# EAGLE design BlinkyBoard_NickBluhm_RevA (EAGLE 9.0.1)
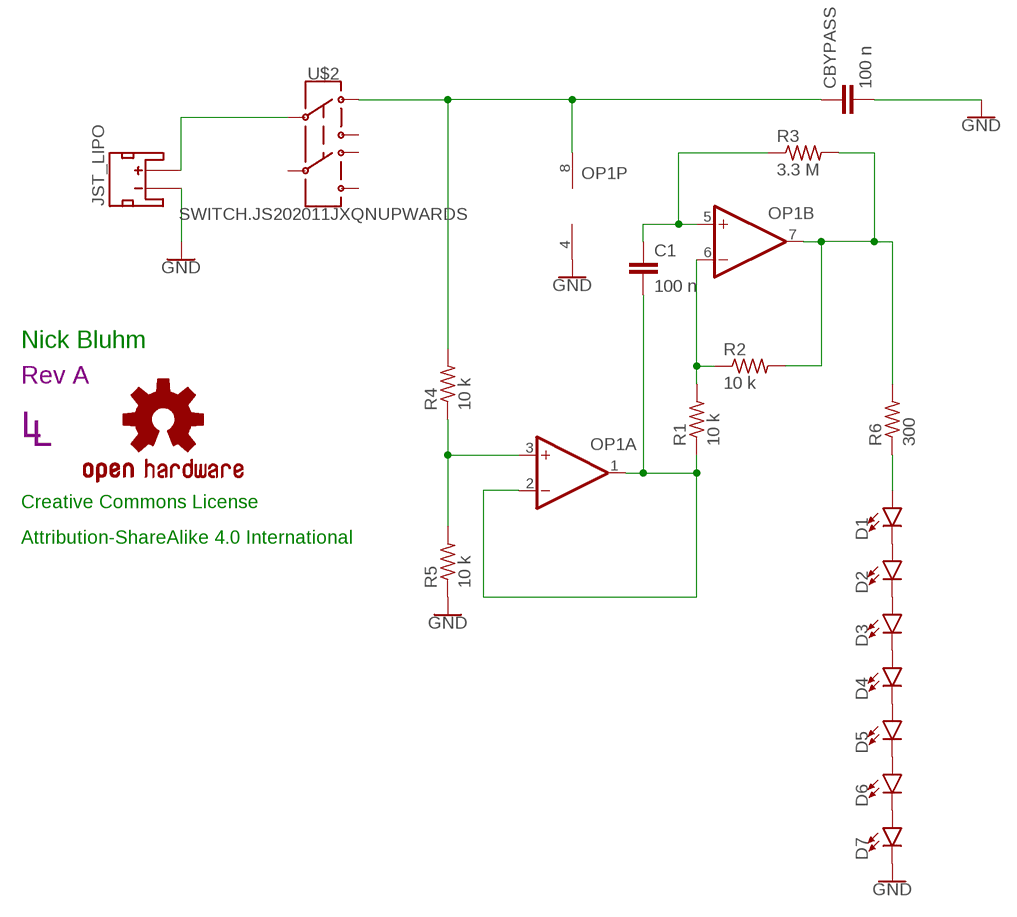
[diagram p0: schematic, sheet 1]

## Parts
C1  100 n  CAPACITOR0402  [C0402]
CBYPASS  100 n  CAPACITOR0402  [C0402]
D1  LED0603  [LED-0603]
D2  LED0603  [LED-0603]
D3  LED0603  [LED-0603]
D4  LED0603  [LED-0603]
D5  LED0603  [LED-0603]
D6  LED0603  [LED-0603]
D7  LED0603  [LED-0603]
JST_LIPO  3.7 V  JST_2MM_MALE  [JST-2-SMD]
LOGO1  OSHW-LOGOL-COPPER  [OSHW-LOGO-L_COPPER]
OP1  OP-DUALRM  [MSOP08]
R1  10 k  RESISTOR0402  [R0402]
R2  10 k  RESISTOR0402  [R0402]
R3  3.3 M  RESISTOR0402  [R0402]
R4  10 k  RESISTOR0402  [R0402]
R5  10 k  RESISTOR0402  [R0402]
R6  300  RESISTOR0402  [R0402]
U$2  SWITCH.JS202011JXQNUPWARDS  [SWITCH.00]
U$4  REVISION.A  [REV.A]
U$5  LINNES.LAB.LOGO  [LINNES.LAB.LOGO]

## Nets
GND: CBYPASS.2 D7.C JST_LIPO.1(-) OP1.4(P:V-) R5.1
N$1: JST_LIPO.2(+) U$2.2
N$2: CBYPASS.1 OP1.8(P:V+) R4.2 U$2.1
N$3: OP1.3(A:+IN) R4.1 R5.2
N$4: C1.2 OP1.1(A:OUT) OP1.2(A:-IN) R1.1
N$5: OP1.6(B:-IN) R1.2 R2.1
N$6: C1.1 OP1.5(B:+IN) R3.1
N$7: OP1.7(B:OUT) R2.2 R3.2 R6.2
N$8: D1.A R6.1
N$9: D1.C D2.A
N$10: D2.C D3.A
N$11: D3.C D4.A
N$12: D4.C D5.A
N$13: D5.C D6.A
N$14: D6.C D7.A
Unconnected: JST_LIPO.NC1(PAD1) JST_LIPO.NC2(PAD2) U$2.3 U$2.5 U$2.6 U$2.7

## Notes on the sheet
- Nick Bluhm
- Creative Commons License
- Attribution-ShareAlike 4.0 International

## Library data of the parts
C1 CBYPASS = CalvEngIO-Passives:CAPACITOR
D1-D7 = CalvEngIO-LED:LED: LED (Generic) Standard schematic elements and footprints for 5mm, 3mm, 1206, and 0603 sized LEDs. Generic LEDs with no color specified. LTST-C190KGKT: arrow indicates cathode
JST_LIPO = CalvEngIO-Connectors:JST_2MM_MALE: JST 2MM MALE RA CONNECTOR Two pin, compact surface mount connector. Commonly used as a battery input connection point. We really like the solid locking feeling and high current rating on these small connectors. We use these all the time as battery connectors. Mates to single-cell LiPo batteries. Here is the connector we sell at SparkFun: JST Right Angle Connector - White <https://www.sparkfun.com/products/8612> (PRT-08612) Datasheet <http://www.sparkfun.com/datasheets/Prototyping/Connectors/JST-Horizontal.pdf> It was used on these SparkFun products: SparkFun MOSFET Power Controller <https://www.sparkfun.com/products/11214> (PRT-11214) SparkFun Battery Babysitter - LiPo Battery Manager <https://www.sparkfun.com/products/13777> (PRT-13777) And many, many others that required a lipo battery connection.; PROD_ID: CONN-11443; SF_ID: PRT-08612
LOGO1 = CalvEngIO-Logos:OSHW-LOGO: Open-Source Hardware (OSHW) Logo This logo indicates the piece of hardware it is found on incorporates a OSHW license and/or adheres to the definition of open source hardware found here: http://freedomdefined.org/OSHW
OP1 = CalvEngIO-AnalogIC:OP-DUAL: Precision Micropower, Low Noise CMOS, Rail-to-Rail Input/Output Operational Amplifiers Source: http://www.analog.com/static/imported-files/data_sheets/AD8603_8607_8609.pdf; MF: ALTERA CORPORATION; MPN: AD8607ARMZ-REEL; OC_FARNELL: 1464990; OC_NEWARK: 59K6925
R1-R6 = CalvEngIO-Passives:RESISTOR
U$2 = CalvEngIO-Switches:SWITCH.JS202011JXQN: Manufacturer's Part Numer: JS202011JAQN for right angle throw JS202011JCQN for top side throw
U$4 = CalvEngIO-Symbols:REVISION.A
U$5 = CalvEngIO-Logos:LINNES.LAB.LOGO

## Board
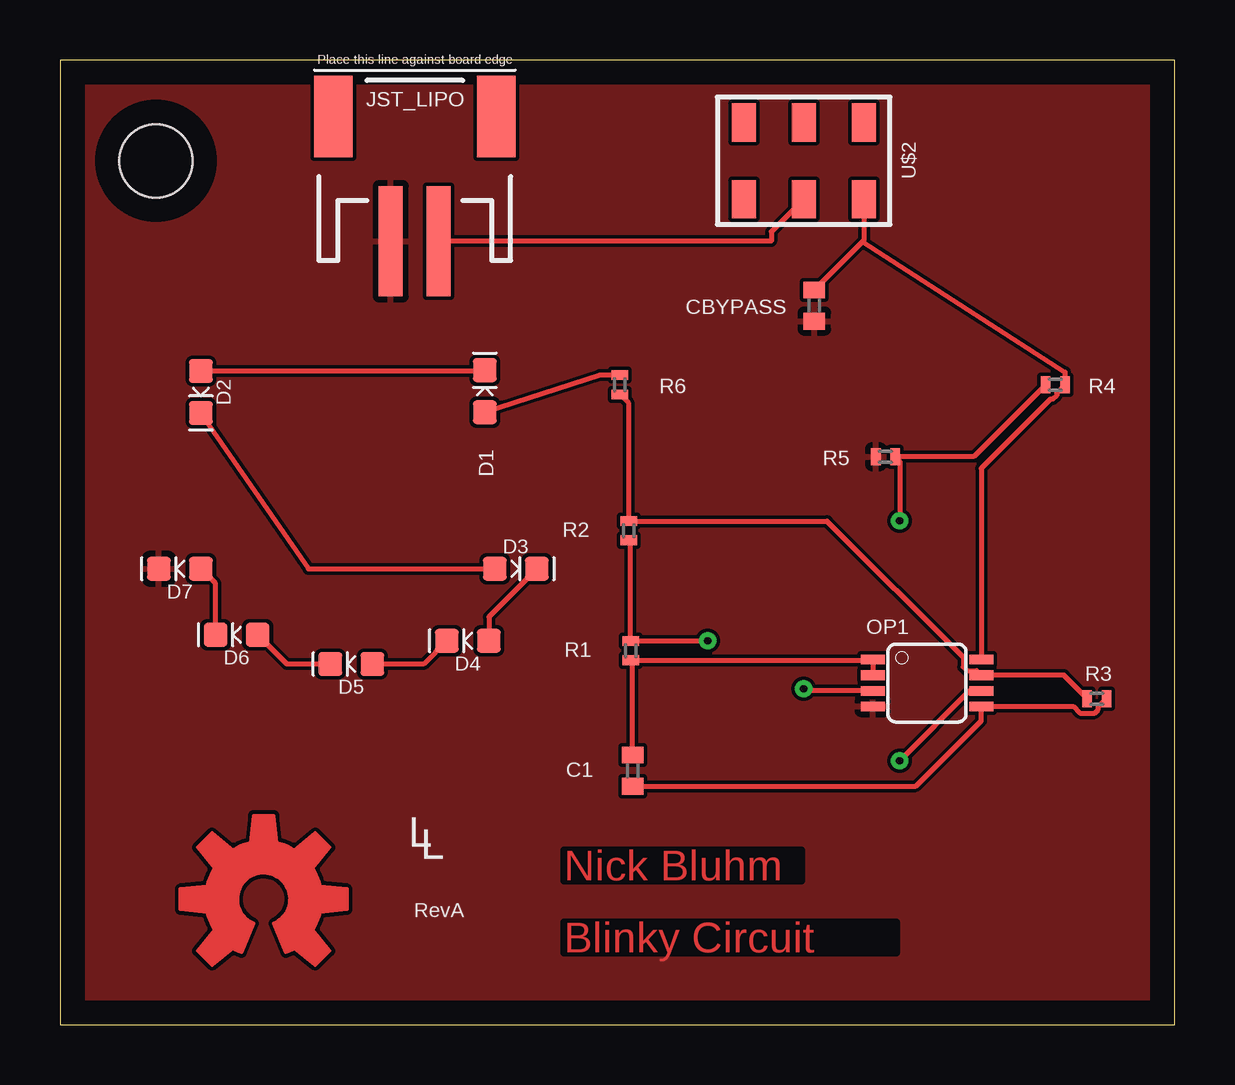
[diagram p1: board, top side]
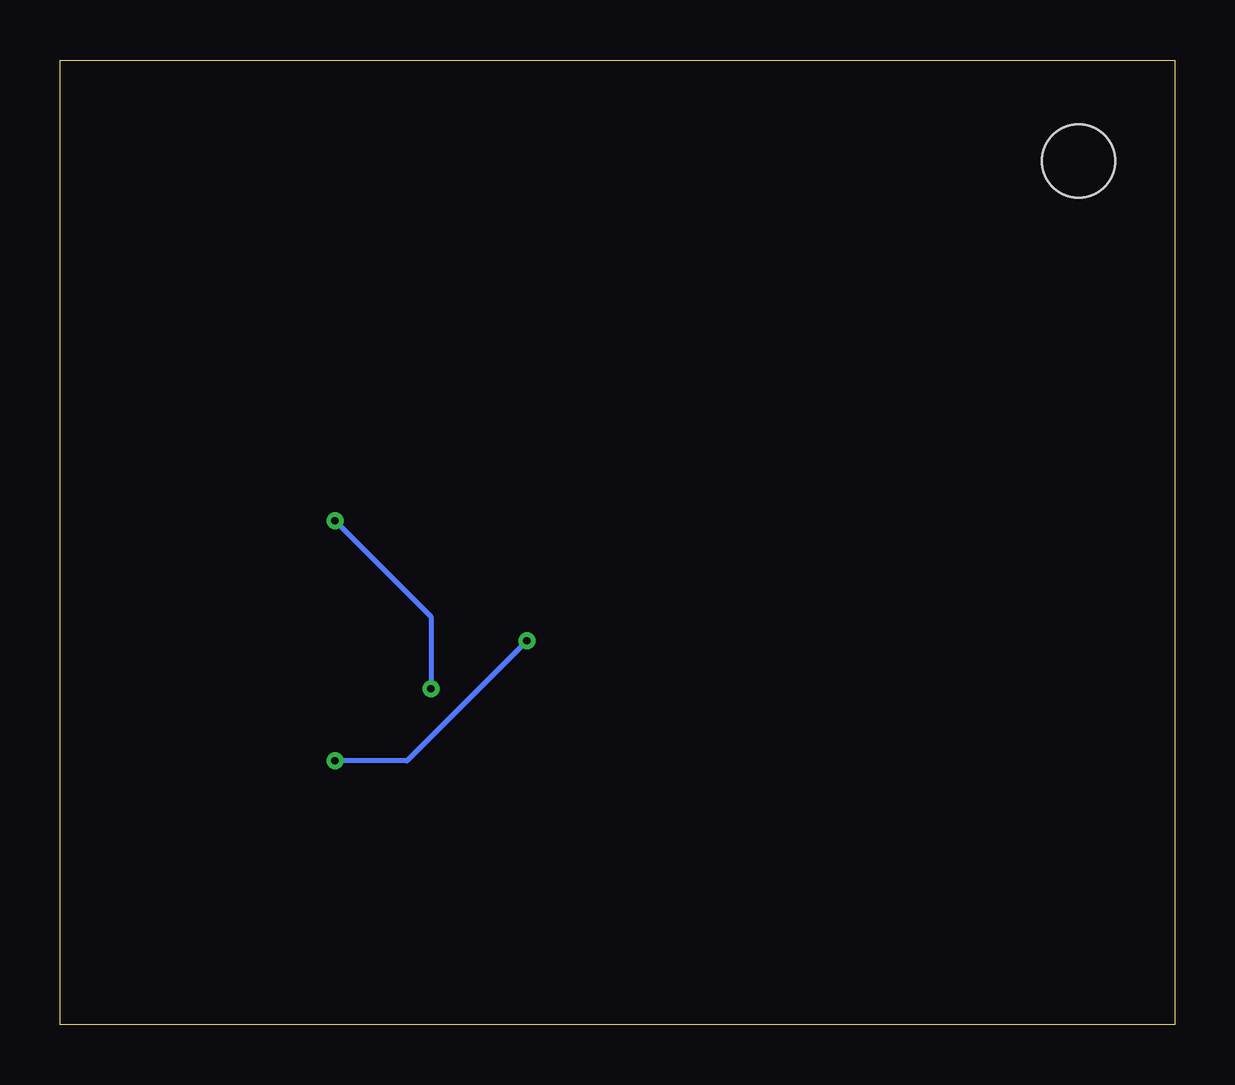
[diagram p2: board, bottom side, seen from below]

Size 46.46 x 40.2 mm. Coordinates in mm from the lower left corner, seen from the top.
Outline: 0,0 46.46,0 46.46,40.2 0,40.2 0,0
Copper layers (1*16): Top 0.035mm / dielectric 1.5mm / Bottom 0.035mm
Design rules "default": minimum track width 6mil, minimum drill 0.35mm, track to track 6mil, track to pad 6mil, pad to pad 6mil, via to via 6mil, smd to smd 6mil, copper to edge 40mil, drill to drill 6mil, minimum pad ring 10mil, minimum via ring 8mil, stop-mask expansion 4mil, vias tented up to drill 0mil, thermal gap 10mil
Holes 3.05 mm at 4,36

### Footprints (pad centres in the part's own frame; a part is rotated, then mirrored left to right if it is on the bottom)
C0402 = smd 0.7 x 0.9: 1 -0.65,0; 2 0.65,0
LED-0603 = smd 1 x 1: A -0.877,0; C 0.877,0
JST-2-SMD = smd 1 x 4.6: 1 -1,-3.7; 2 1,-3.7 | smd 1.6 x 3.4: NC1 -3.4,1.5; NC2 3.4,1.5
MSOP08 = smd 0.4 x 1: 1 -0.976,-2.263; 2 -0.326,-2.263; 3 0.324,-2.263; 4 0.974,-2.263; 5 0.974,2.262; 6 0.324,2.262; 7 -0.326,2.262; 8 -0.976,2.262
R0402 = smd 0.4 x 0.7: 1 -0.4,0; 2 0.4,0
SWITCH.00 = smd 1 x 1.6: 1 -2.5,1.6; 2 0,1.6; 3 2.5,1.6; 5 -2.5,-1.6; 6 0,-1.6; 7 2.5,-1.6

### Placement (x,y rotation side)
C1  23.87,10.59 90 top
CBYPASS  31.44,29.97 270 top
D1  17.71,26.4 90 top
D2  5.87,26.36 270 top
D3  19,19 0 top
D4  17,16 180 top
D5  12.14,15.03 180 top
D6  7.37,16.25 180 top
D7  5,19 180 top
JST_LIPO  14.79,36.35 0 top
LOGO1  8.49,5.24 0 top
OP1  36.14,14.24 270 top
R1  23.79,15.59 90 top
R2  23.71,20.59 90 top
R3  43.22,13.59 180 top
R4  41.49,26.67 0 top
R5  34.41,23.67 0 top
R6  23.33,26.67 270 top
U$2  31,36 180 top
U$4  14.76,4.48 0 top
U$5  14.52,7.4 0 top

### Tracks (layer width: path | path; a pad name or v marks a point on that pad's centre or on a via)
GND
  pour Top: -6,52 -6,-7 -7,-8 57,-8 61,-12 61,54 57,58 -1,58 -1,57
N$1
  Top 0.203: JST_LIPO.2 29.65,32.65 29.65,33.05 U$2.2
N$2
  Top 0.203: CBYPASS.1 33.45,32.63 | 33.45,32.63 41.89,27.19 R4.2 41.54,26.32 41.54,26.21 41.4,26.07 41.29,26.07 38.4,23.18 OP1.8 | U$2.1 33.5,32.68 33.45,32.63
N$3  (via drill 0.3 pad 0.12)
  Top 0.203: R4.1 38.09,23.67 R5.2 35,23.48 v35,21 | OP1.3 31.08,13.92 v31,14
  Bottom 0.203: v35,21 31,17 v31,14
N$4
  Top 0.152: 23.87,15.11 R1.1 | 33.85,15.19 OP1.1
  Top 0.203: C1.2 23.87,15.11 | R1.1 33.85,15.19 | OP1.1 OP1.2
N$5  (via drill 0.3 pad 0.12)
  Top 0.152: 23.79,20.11 R2.1
  Top 0.203: v35,11 37.92,13.92 OP1.6 | 23.79,20.11 R1.2 v27,16
  Bottom 0.203: v27,16 32,11 v35,11
N$6
  Top 0.203: C1.1 35.67,9.94 38.4,12.67 OP1.5 42.23,13.27 42.52,12.99 43.12,12.99 43.27,13.13 43.27,13.24 R3.1
N$7
  Top 0.203: R3.2 41.84,14.57 OP1.7 38.21,14.76 37.8,14.76 37.65,14.91 37.65,15.32 31.98,20.99 R2.2 23.71,25.89 R6.2
N$8
  Top 0.203: R6.1 22.5,27.07 D1.A
N$9
  Top 0.203: D2.A 17.68,27.24 D1.C
N$10
  Top 0.203: D2.C 10.36,19 D3.A
N$11
  Top 0.203: D3.C 17.88,17 D4.A
N$12
  Top 0.203: D4.C 15.15,15.03 D5.A
N$13
  Top 0.203: D5.C 9.46,15.03 D6.A
N$14
  Top 0.203: D6.C 6.49,18.39 D7.A

### Text on the board
Top: Nick Bluhm | Blinky Circuit